# Altium schematic sheet 主控制器.SchDoc
size A1
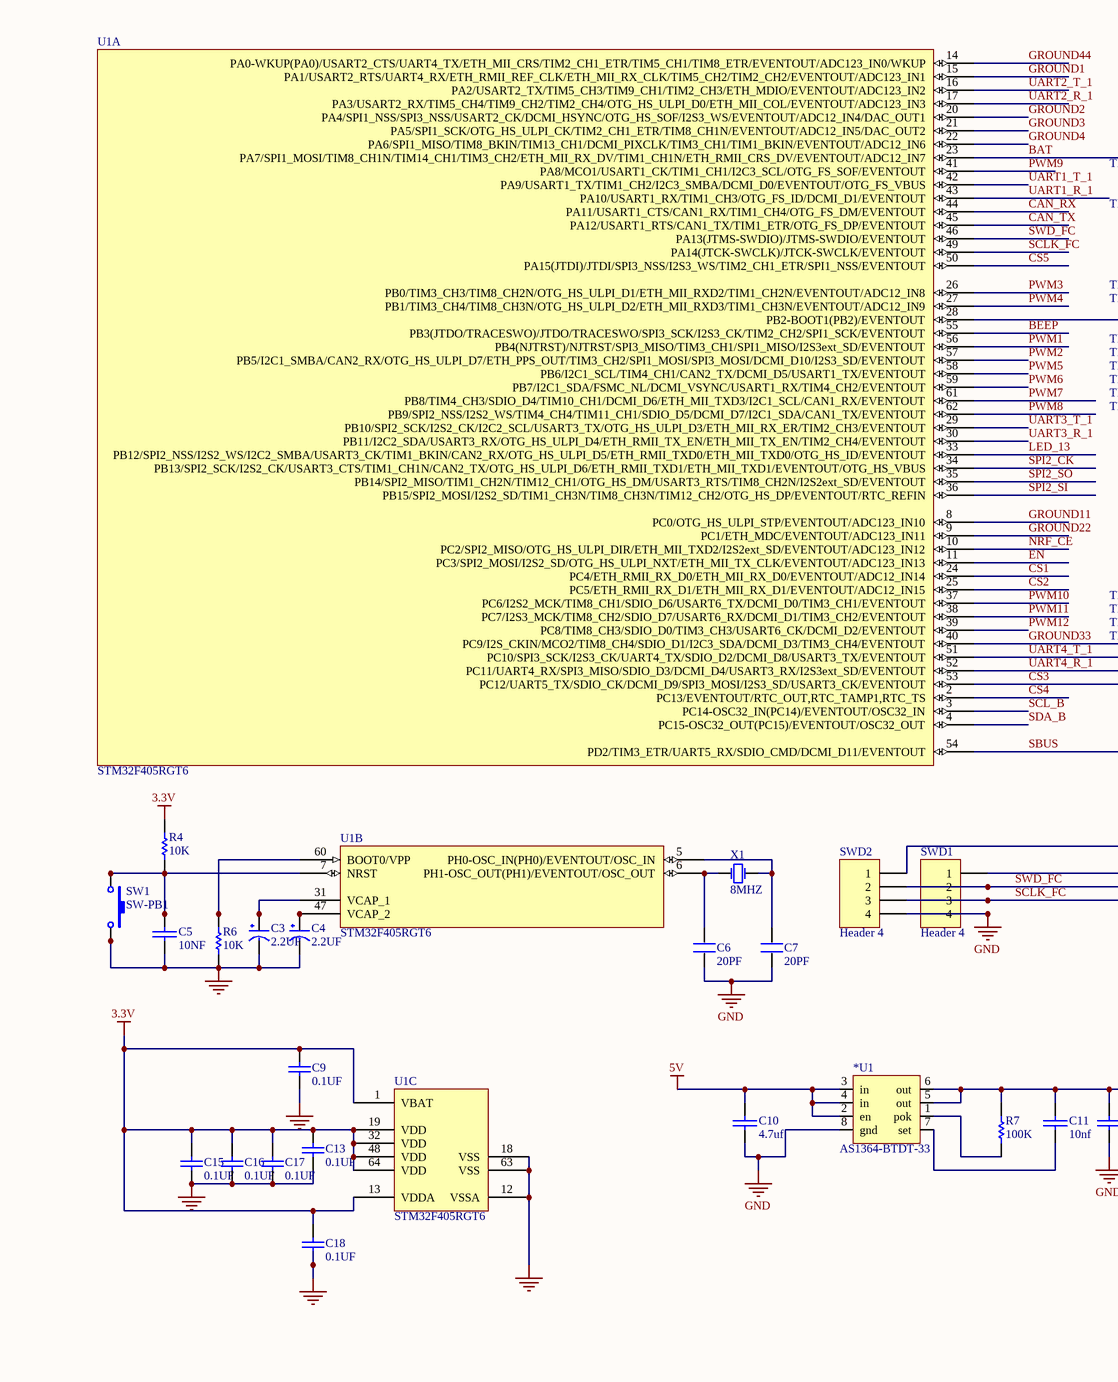
[diagram p0: 主控制器.SchDoc, top left]
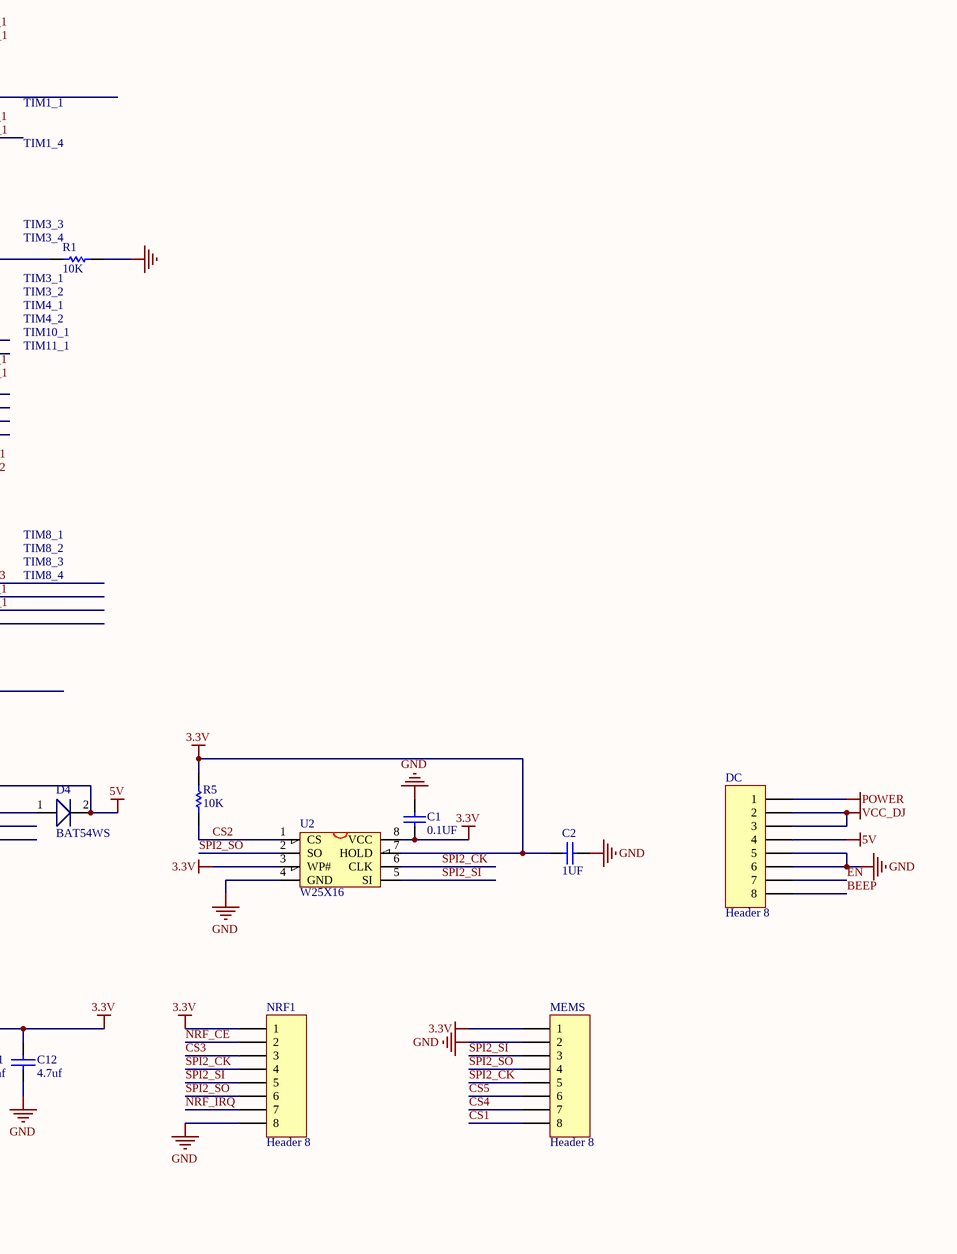
[diagram p1: 主控制器.SchDoc, top right]
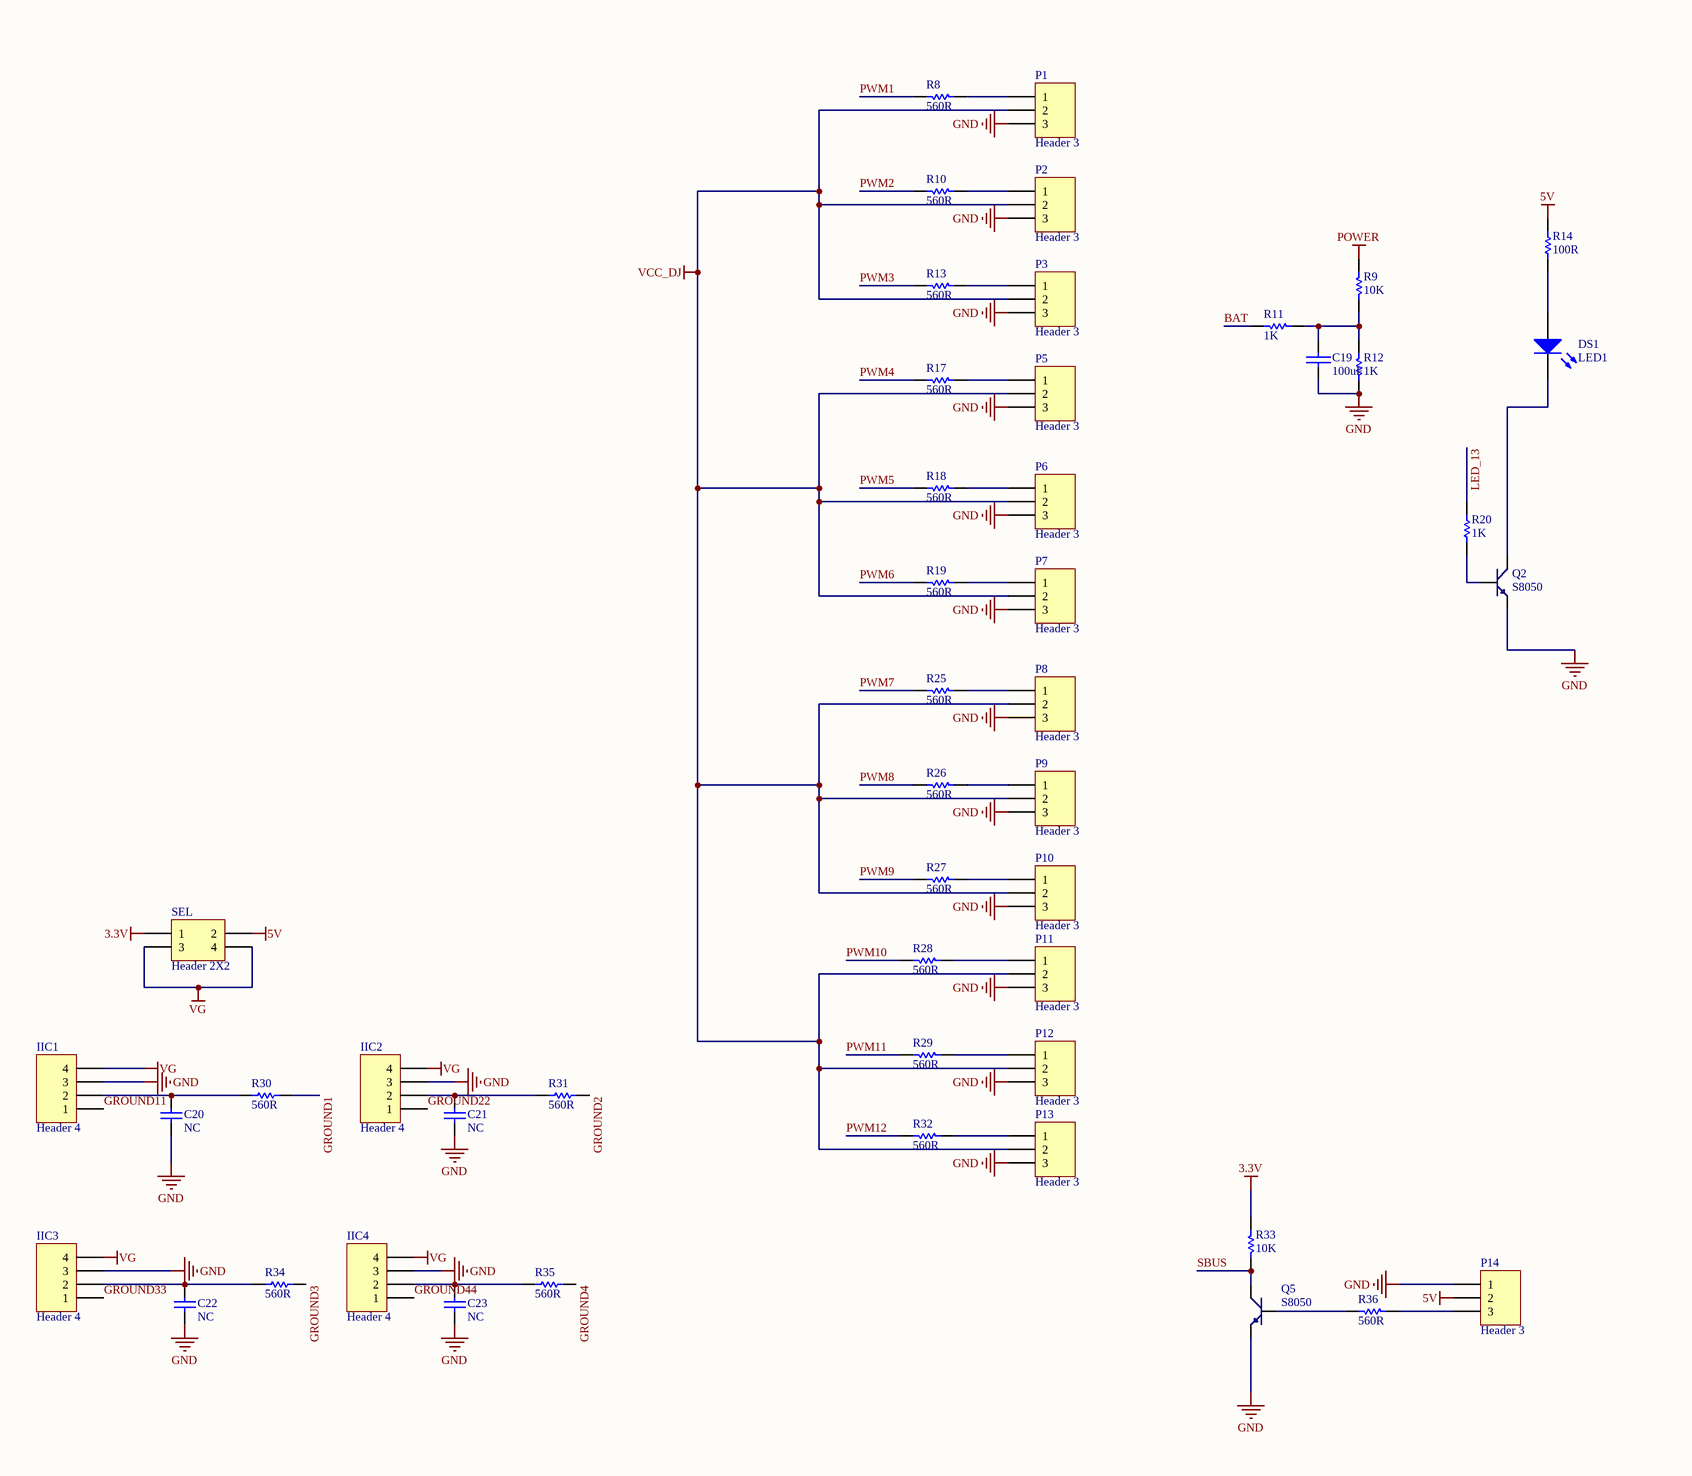
[diagram p2: 主控制器.SchDoc, bottom left]
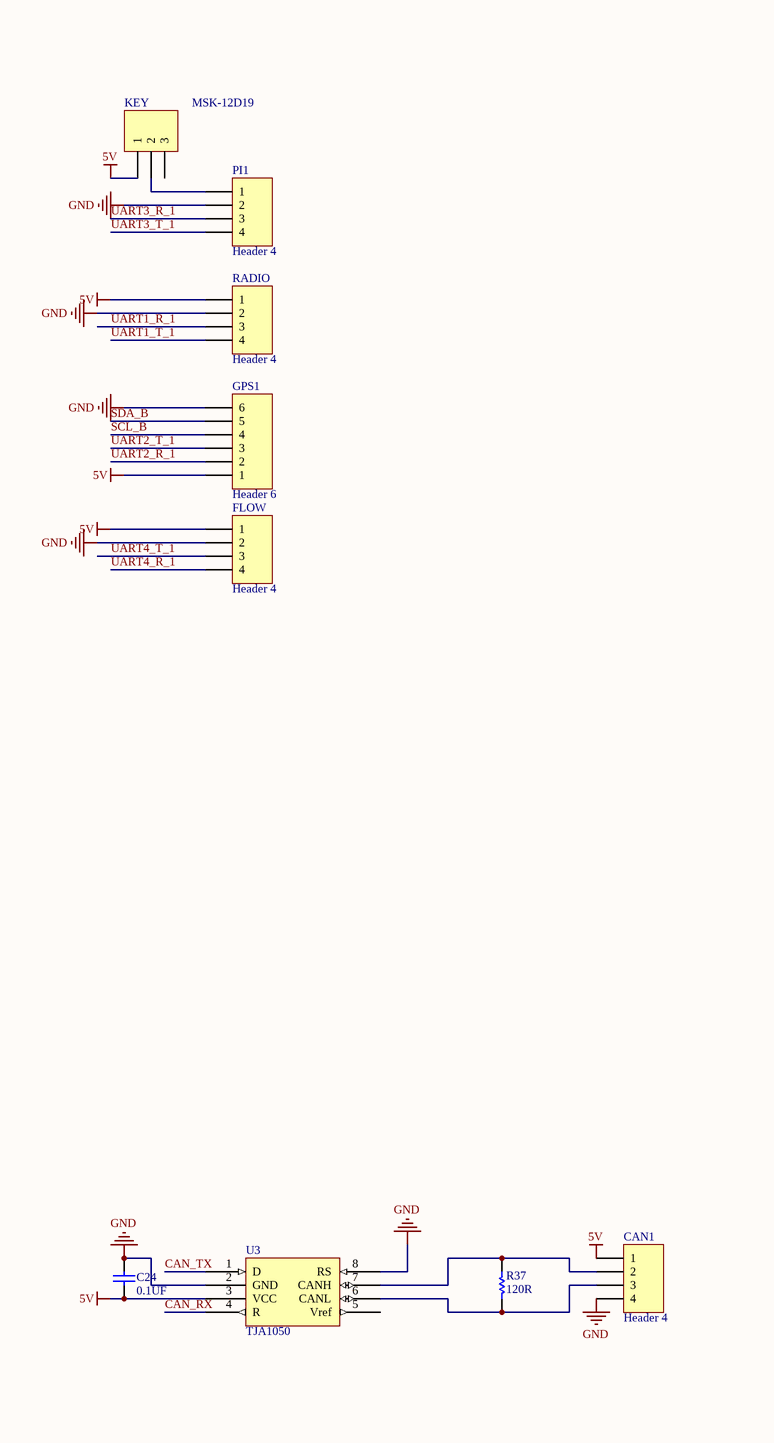
[diagram p3: 主控制器.SchDoc, bottom right]

## Parts
*U1  AS1364-BTDT-33  [TDFN-8]
C1  0.1UF  [C 0402]
C2  1UF  [C 0402]
C3  2.2UF  [C0603]
C4  2.2UF  [C0603]
C5  10NF  [C 0402]
C6  20PF  [C 0402]
C7  20PF  [C 0402]
C9  0.1UF  [C 0402]
C10  4.7uf  [C0603]
C11  10nf  [C0603]
C12  4.7uf  [C0603]
C13  0.1UF  [C 0402]
C15  0.1UF  [C 0402]
C16  0.1UF  [C 0402]
C17  0.1UF  [C 0402]
C18  0.1UF  [C 0402]
C19  100uF  [C0603]
C20  NC  [C0603]
C21  NC  [C0603]
C22  NC  [C0603]
C23  NC  [C0603]
C24  0.1UF  [C 0402]
CAN1  Header 4  [PH2.0-4]
D4  BAT54WS  [SOD-323]
DC  Header 8  [HDR1X8]
DS1  LED1  [SMDLED]
FLOW  Header 4  [JST_GH_V4]
GPS1  Header 6  [JST_GH_V6]
IIC1  Header 4  [JST_GH_V4]
IIC2  Header 4  [JST_GH_V4]
IIC3  Header 4  [JST_GH_V4]
IIC4  Header 4  [JST_GH_V4]
KEY  MSK-12D19  [HDR1X3]
MEMS  Header 8  [FH12-8S-1.0SH]
NRF1  Header 8  [NRF]
P1  Header 3  [HDR1X3]
P2  Header 3  [HDR1X3]
P3  Header 3  [HDR1X3]
P5  Header 3  [HDR1X3]
P6  Header 3  [HDR1X3]
P7  Header 3  [HDR1X3]
P8  Header 3  [HDR1X3]
P9  Header 3  [HDR1X3]
P10  Header 3  [HDR1X3]
P11  Header 3  [HDR1X3]
P12  Header 3  [HDR1X3]
P13  Header 3  [HDR1X3]
P14  Header 3  [HDR1X3]
PI1  Header 4  [HDR1X4]
Q2  S8050  [SOT-23R]
Q5  S8050  [SOT-23R]
R1  10K  [R 0402]
R4  10K  [R 0402]
R5  10K  [R 0402]
R6  10K  [R 0402]
R7  100K  [R0603]
R8  560R  [R 0402]
R9  10K  [R0603]
R10  560R  [R 0402]
R11  1K  [R0603]
R12  1K  [R0603]
R13  560R  [R 0402]
R14  100R  [R 0402]
R17  560R  [R 0402]
R18  560R  [R 0402]
R19  560R  [R 0402]
R20  1K  [R 0402]
R25  560R  [R 0402]
R26  560R  [R 0402]
R27  560R  [R 0402]
R28  560R  [R 0402]
R29  560R  [R 0402]
R30  value 560R  [R0603]  (hidden comment: 1K)
R31  value 560R  [R0603]  (hidden comment: 1K)
R32  560R  [R 0402]
R33  10K  [R 0402]
R34  value 560R  [R0603]  (hidden comment: 1K)
R35  value 560R  [R0603]  (hidden comment: 1K)
R36  560R  [R 0402]
R37  120R  [R0603]
RADIO  Header 4  [JST_GH_V4]
SEL  Header 2X2  [HDR2X2]
SW1  SW-PB1  [KEY_SAD]
SWD1  Header 4  [JST_GH_V4]
SWD2  Header 4  [HDR1X4]
U1  STM32F405RGT6  [LQFP64_M]  (parts A,B,C of 3)
U2  W25X16  [W25Q32FVZPIG]
U3  TJA1050  [SOP-8]
X1  8MHZ  [PXCL]

## Nets
3.3V: *U1.5(out) *U1.6(out) C1.1 C2.2 C9.1 C11.1 C12.1 C13.1 C15.1 C16.1 C17.1 C18.1 MEMS.1 NRF1.1 R4.2 R5.1 R7.1 R33.2 SEL.1 U1.1(VBAT) U1.13(VDDA) U1.19(VDD) U1.32(VDD) U1.48(VDD) U1.64(VDD) U2.3(WP#) U2.7(HOLD) U2.8(VCC)
5V: *U1.2(en) *U1.3(in) *U1.4(in) C10.1 C24.2 CAN1.1 D4.2 DC.4 FLOW.1 GPS1.1 KEY.1 P14.2 R14.1 RADIO.1 SEL.2 SWD2.1 U3.3(VCC)
GND: *U1.8(gnd) C1.2 C2.1 C3.2(GND) C4.2(GND) C5.1 C6.1 C7.1 C9.2 C10.2 C12.2 C13.2 C15.2 C16.2 C17.2 C18.2 C19.2 C20.2 C21.2 C22.2 C23.2 C24.1 CAN1.4 DC.5 DC.6 FLOW.2 GPS1.6 IIC1.3 IIC2.3 IIC3.3 IIC4.3 MEMS.2 NRF1.8 P1.3 P2.3 P3.3 P5.3 P6.3 P7.3 P8.3 P9.3 P10.3 P11.3 P12.3 P13.3 P14.1 PI1.2 Q2.1(E) Q5.1(E) R1.1 R6.1 R12.1 RADIO.2 SW1.1 SWD1.4 SWD2.4 U1.12(VSSA) U1.18(VSS) U1.63(VSS) U2.4(GND) U3.2(GND) U3.8(RS)
POWER: DC.1 R9.2
VCC_DJ: DC.2 DC.3 P1.2 P2.2 P3.2 P5.2 P6.2 P7.2 P8.2 P9.2 P10.2 P11.2 P12.2 P13.2
VG: IIC1.4 IIC2.4 IIC3.4 IIC4.4 SEL.3 SEL.4
BAT: R11.1 U1.23(PA7/SPI1_MOSI/TIM8_CH1N/TIM14_CH1/TIM3_CH2/ETH_MII_RX_DV/TIM1_CH1N/ETH_RMII_CRS_DV/EVENTOUT/ADC12_IN7)
BEEP: DC.8 U1.55(PB3(JTDO/TRACESWO)/JTDO/TRACESWO/SPI3_SCK/I2S3_CK/TIM2_CH2/SPI1_SCK/EVENTOUT)
CAN_RX: U1.44(PA11/USART1_CTS/CAN1_RX/TIM1_CH4/OTG_FS_DM/EVENTOUT) U3.4(R)  [also labelled CAN_RX ]
CAN_TX : U1.45(PA12/USART1_RTS/CAN1_TX/TIM1_ETR/OTG_FS_DP/EVENTOUT) U3.1(D)
CS1: MEMS.8 U1.24(PC4/ETH_RMII_RX_D0/ETH_MII_RX_D0/EVENTOUT/ADC12_IN14)
CS2: R5.2 U1.25(PC5/ETH_RMII_RX_D1/ETH_MII_RX_D1/EVENTOUT/ADC12_IN15) U2.1(CS)
CS3: NRF1.3 U1.53(PC12/UART5_TX/SDIO_CK/DCMI_D9/SPI3_MOSI/I2S3_SD/USART3_CK/EVENTOUT)
CS4: MEMS.7 U1.2(PC13/EVENTOUT/RTC_OUT,RTC_TAMP1,RTC_TS)
CS5: MEMS.6 U1.50(PA15(JTDI)/JTDI/SPI3_NSS/I2S3_WS/TIM2_CH1_ETR/SPI1_NSS/EVENTOUT)
EN: DC.7 U1.11(PC3/SPI2_MOSI/I2S2_SD/OTG_HS_ULPI_NXT/ETH_MII_TX_CLK/EVENTOUT/ADC123_IN13)
GROUND1: R30.2 U1.15(PA1/USART2_RTS/UART4_RX/ETH_RMII_REF_CLK/ETH_MII_RX_CLK/TIM5_CH2/TIM2_CH2/EVENTOUT/ADC123_IN1)
GROUND2: R31.2 U1.20(PA4/SPI1_NSS/SPI3_NSS/USART2_CK/DCMI_HSYNC/OTG_HS_SOF/I2S3_WS/EVENTOUT/ADC12_IN4/DAC_OUT1)
GROUND3: R34.2 U1.21(PA5/SPI1_SCK/OTG_HS_ULPI_CK/TIM2_CH1_ETR/TIM8_CH1N/EVENTOUT/ADC12_IN5/DAC_OUT2)
GROUND4: R35.2 U1.22(PA6/SPI1_MISO/TIM8_BKIN/TIM13_CH1/DCMI_PIXCLK/TIM3_CH1/TIM1_BKIN/EVENTOUT/ADC12_IN6)
GROUND11: IIC1.1 U1.8(PC0/OTG_HS_ULPI_STP/EVENTOUT/ADC123_IN10)
GROUND22: IIC2.1 U1.9(PC1/ETH_MDC/EVENTOUT/ADC123_IN11)
GROUND33: IIC3.1 U1.40(PC9/I2S_CKIN/MCO2/TIM8_CH4/SDIO_D1/I2C3_SDA/DCMI_D3/TIM3_CH4/EVENTOUT)
GROUND44: IIC4.1 U1.14(PA0-WKUP(PA0)/USART2_CTS/UART4_TX/ETH_MII_CRS/TIM2_CH1_ETR/TIM5_CH1/TIM8_ETR/EVENTOUT/ADC123_IN0/WKUP)
LED_13: R20.1 U1.33(PB12/SPI2_NSS/I2S2_WS/I2C2_SMBA/USART3_CK/TIM1_BKIN/CAN2_RX/OTG_HS_ULPI_D5/ETH_RMII_TXD0/ETH_MII_TXD0/OTG_HS_ID/EVENTOUT)
NRF_CE: NRF1.2 U1.10(PC2/SPI2_MISO/OTG_HS_ULPI_DIR/ETH_MII_TXD2/I2S2ext_SD/EVENTOUT/ADC123_IN12)
NRF_IRQ: NRF1.7
PWM1: R8.1 U1.56(PB4(NJTRST)/NJTRST/SPI3_MISO/TIM3_CH1/SPI1_MISO/I2S3ext_SD/EVENTOUT)
PWM2: R10.1 U1.57(PB5/I2C1_SMBA/CAN2_RX/OTG_HS_ULPI_D7/ETH_PPS_OUT/TIM3_CH2/SPI1_MOSI/SPI3_MOSI/DCMI_D10/I2S3_SD/EVENTOUT)
PWM3: R13.1 U1.26(PB0/TIM3_CH3/TIM8_CH2N/OTG_HS_ULPI_D1/ETH_MII_RXD2/TIM1_CH2N/EVENTOUT/ADC12_IN8)
PWM4: R17.1 U1.27(PB1/TIM3_CH4/TIM8_CH3N/OTG_HS_ULPI_D2/ETH_MII_RXD3/TIM1_CH3N/EVENTOUT/ADC12_IN9)
PWM5: R18.1 U1.58(PB6/I2C1_SCL/TIM4_CH1/CAN2_TX/DCMI_D5/USART1_TX/EVENTOUT)
PWM6: R19.1 U1.59(PB7/I2C1_SDA/FSMC_NL/DCMI_VSYNC/USART1_RX/TIM4_CH2/EVENTOUT)
PWM7: R25.1 U1.61(PB8/TIM4_CH3/SDIO_D4/TIM10_CH1/DCMI_D6/ETH_MII_TXD3/I2C1_SCL/CAN1_RX/EVENTOUT)
PWM8: R26.1 U1.62(PB9/SPI2_NSS/I2S2_WS/TIM4_CH4/TIM11_CH1/SDIO_D5/DCMI_D7/I2C1_SDA/CAN1_TX/EVENTOUT)
PWM9: R27.1 U1.41(PA8/MCO1/USART1_CK/TIM1_CH1/I2C3_SCL/OTG_FS_SOF/EVENTOUT)
PWM10: R28.1 U1.37(PC6/I2S2_MCK/TIM8_CH1/SDIO_D6/USART6_TX/DCMI_D0/TIM3_CH1/EVENTOUT)
PWM11: R29.1 U1.38(PC7/I2S3_MCK/TIM8_CH2/SDIO_D7/USART6_RX/DCMI_D1/TIM3_CH2/EVENTOUT)
PWM12: R32.1 U1.39(PC8/TIM8_CH3/SDIO_D0/TIM3_CH3/USART6_CK/DCMI_D2/EVENTOUT)
SBUS: Q5.3(C) R33.1 U1.54(PD2/TIM3_ETR/UART5_RX/SDIO_CMD/DCMI_D11/EVENTOUT)
SCL_B: GPS1.4 U1.3(PC14-OSC32_IN(PC14)/EVENTOUT/OSC32_IN)
SCLK_FC: SWD1.3 SWD2.3 U1.49(PA14(JTCK-SWCLK)/JTCK-SWCLK/EVENTOUT)
SDA_B: GPS1.5 U1.4(PC15-OSC32_OUT(PC15)/EVENTOUT/OSC32_OUT)
SPI2_CK: MEMS.5 NRF1.4 U1.34(PB13/SPI2_SCK/I2S2_CK/USART3_CTS/TIM1_CH1N/CAN2_TX/OTG_HS_ULPI_D6/ETH_RMII_TXD1/ETH_MII_TXD1/EVENTOUT/OTG_HS_VBUS) U2.6(CLK)
SPI2_SI: MEMS.3 NRF1.5 U1.36(PB15/SPI2_MOSI/I2S2_SD/TIM1_CH3N/TIM8_CH3N/TIM12_CH2/OTG_HS_DP/EVENTOUT/RTC_REFIN) U2.5(SI)
SPI2_SO: MEMS.4 NRF1.6 U1.35(PB14/SPI2_MISO/TIM1_CH2N/TIM12_CH1/OTG_HS_DM/USART3_RTS/TIM8_CH2N/I2S2ext_SD/EVENTOUT) U2.2(SO)
SWD_FC: SWD1.2 SWD2.2 U1.46(PA13(JTMS-SWDIO)/JTMS-SWDIO/EVENTOUT)
UART1_R_1: RADIO.3 U1.43(PA10/USART1_RX/TIM1_CH3/OTG_FS_ID/DCMI_D1/EVENTOUT)
UART1_T_1: RADIO.4 U1.42(PA9/USART1_TX/TIM1_CH2/I2C3_SMBA/DCMI_D0/EVENTOUT/OTG_FS_VBUS)
UART2_R_1: GPS1.2 U1.17(PA3/USART2_RX/TIM5_CH4/TIM9_CH2/TIM2_CH4/OTG_HS_ULPI_D0/ETH_MII_COL/EVENTOUT/ADC123_IN3)
UART2_T_1: GPS1.3 U1.16(PA2/USART2_TX/TIM5_CH3/TIM9_CH1/TIM2_CH3/ETH_MDIO/EVENTOUT/ADC123_IN2)
UART3_R_1: PI1.3 U1.30(PB11/I2C2_SDA/USART3_RX/OTG_HS_ULPI_D4/ETH_RMII_TX_EN/ETH_MII_TX_EN/TIM2_CH4/EVENTOUT)
UART3_T_1: PI1.4 U1.29(PB10/SPI2_SCK/I2S2_CK/I2C2_SCL/USART3_TX/OTG_HS_ULPI_D3/ETH_MII_RX_ER/TIM2_CH3/EVENTOUT)
UART4_R_1: FLOW.4 U1.52(PC11/UART4_RX/SPI3_MISO/SDIO_D3/DCMI_D4/USART3_RX/I2S3ext_SD/EVENTOUT)
UART4_T_1: FLOW.3 U1.51(PC10/SPI3_SCK/I2S3_CK/UART4_TX/SDIO_D2/DCMI_D8/USART3_TX/EVENTOUT)
Net*U1_1: *U1.1(pok) R7.2
Net*U1_7: *U1.7(set) C11.2
NetC3_1: C3.1(VCC) U1.31(VCAP_1)
NetC4_1: C4.1(VCC) U1.47(VCAP_2)
NetC5_2: C5.2 R4.1 SW1.2 U1.7(NRST)
NetC6_2: C6.2 U1.6(PH1-OSC_OUT(PH1)/EVENTOUT/OSC_OUT) X1.1(OSC1)
NetC7_2: C7.2 U1.5(PH0-OSC_IN(PH0)/EVENTOUT/OSC_IN) X1.2(OSC2)
NetC19_1: C19.1 R9.1 R11.2 R12.2
NetC20_1: C20.1 IIC1.2 R30.1
NetC21_1: C21.1 IIC2.2 R31.1
NetC22_1: C22.1 IIC3.2 R34.1
NetC23_1: C23.1 IIC4.2 R35.1
NetCAN1_2: CAN1.2 R37.2 U3.7(CANH)
NetCAN1_3: CAN1.3 R37.1 U3.6(CANL)
NetD4_1: D4.1 SWD1.1
NetDS1_1: DS1.1(A) R14.2
NetDS1_2: DS1.2(K) Q2.3(C)
NetKEY_2: KEY.2 PI1.1
NetP1_1: P1.1 R8.2
NetP2_1: P2.1 R10.2
NetP3_1: P3.1 R13.2
NetP5_1: P5.1 R17.2
NetP6_1: P6.1 R18.2
NetP7_1: P7.1 R19.2
NetP8_1: P8.1 R25.2
NetP9_1: P9.1 R26.2
NetP10_1: P10.1 R27.2
NetP11_1: P11.1 R28.2
NetP12_1: P12.1 R29.2
NetP13_1: P13.1 R32.2
NetP14_3: P14.3 R36.2
NetQ2_2: Q2.2(B) R20.2
NetQ5_2: Q5.2(B) R36.1
NetR1_2: R1.2 U1.28(PB2-BOOT1(PB2)/EVENTOUT)
NetR6_2: R6.2 U1.60(BOOT0/VPP)

Not connected (* = marked no-connect by the designer): KEY 3; U3 5(Vref)

## Notes on the sheet
- TIM1_1
- TIM1_4
- (near R1) TIM3_3
- (near R1) TIM3_4
- (near R1) TIM3_1
- (near R1) TIM3_2
- (near R1) TIM4_1
- TIM4_2
- TIM10_1
- TIM11_1
- TIM8_1
- TIM8_2
- TIM8_3
- TIM8_4

## Library data of the parts
*U1 = AS1364-3.3V
C1 C2 C9 C13 C15-C18 C20-C24 = CAP: Capacitor; Value: 100nF; Published: 8-Jun-2000; Revision: July-2002: Re-released for DXP Platform.; Publisher: Altium Limited
C3 C4 = CAP1: 胆电容
C5 C10-C12 C19 = CAP: Capacitor
C6 C7 = C2: 0805
CAN1 FLOW IIC1-IIC4 PI1 RADIO SWD1 SWD2 = Header 4: Header, 4-Pin; LatestRevisionDate: 17-Jul-2002; LatestRevisionNote: Re-released for DXP Platform.; Publisher: Altium Limited
D4 = BAT54: 单肖特基二极管
DC MEMS NRF1 = Header 8: Header, 8-Pin; LatestRevisionDate: 17-Jul-2002; LatestRevisionNote: Re-released for DXP Platform.; Publisher: Altium Limited
DS1 = LED2: Typical RED, GREEN, YELLOW, AMBER GaAs LED; Published: 8-Jun-2000; LatestRevisionDate: 17-Jul-2002; LatestRevisionNote: Re-released for DXP Platform.; PackageDocument: Feb-2002; PackageReference: 3.2X1.6X1.1; Publisher: Altium Limited
GPS1 = Header 6: Header, 6-Pin; LatestRevisionDate: 17-Jul-2002; LatestRevisionNote: Re-released for DXP Platform.; Publisher: Altium Limited
KEY P1-P3 P5-P14 = Header 3: Header, 3-Pin; LatestRevisionDate: 17-Jul-2002; LatestRevisionNote: Re-released for DXP Platform.; Publisher: Altium Limited
Q2 Q5 = NPN: 8050/BCW846/BCW847
R1 R4-R6 R8-R14 R17-R20 R25-R29 R32 R33 R36 R37 = Res2: 0603
R7 R30 R31 R34 R35 = Res1: Resistor; Published: 8-Jun-2000; Revision: July-2002: Re-released for DXP Platform.; Publisher: Altium Limited
  R7: Value: 100K
SEL = Header 2X2: Header, 2-Pin, Dual row; LatestRevisionDate: 17-Jul-2002; LatestRevisionNote: Re-released for DXP Platform.; Publisher: Altium Limited
SW1 = S: 按键
U2 = W25X16: W25X16;SST25VF016;MX25L1605
U3 = SN65HVD230D
X1 = XTAL: Crystal Oscillator; Published: 8-Jun-2000; LatestRevisionDate: 17-Jul-2002; LatestRevisionNote: Re-released for DXP Platform.; Publisher: Altium Limited